# EAGLE schematic Schematic_PM (EAGLE 9.7.0)
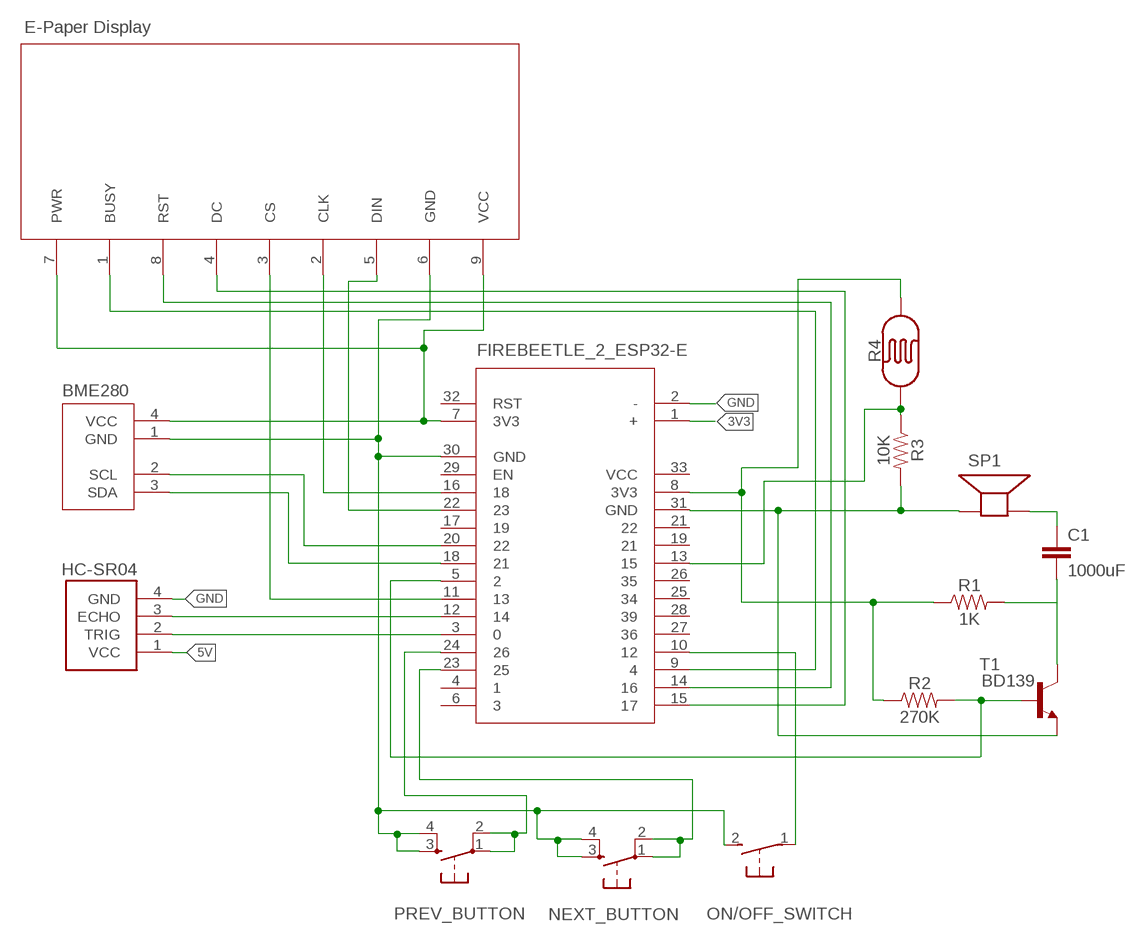
[diagram p0: schematic, sheet 1]

## Parts
BME280  BME280BME280  [WE-LAN_749023010A]
C1  1000uF  DNP-0603_NO_CREAM  [0603_NO_CREAM]
FIREBEETLE_2_ESP32-E  ESP32ESP32  [QFP50P1600X1600X160-100N]
NEXT_BUTTON  SPARKFUN-SWITCHES_MOMENTARY-SWITCH-SPST-2-SMD-4.6X2.8MM  [SPARKFUN-SWITCHES_TACTILE_SWITCH_SMD_4.6X2.8MM]
ON/OFF_SWITCH  31-XXSKINNY  [B3F-31XX-SKINNIER]
PREV_BUTTON  SPARKFUN-SWITCHES_MOMENTARY-SWITCH-SPST-2-SMD-4.6X2.8MM  [SPARKFUN-SWITCHES_TACTILE_SWITCH_SMD_4.6X2.8MM]
R1  1K  1.07KOHM0402-0.1%-1/10W  [0402-TIGHT]
R2  270K  15KOHM-0402-TIGHT-1/16THW-1%  [0402-TIGHT]
R3  10K  10KOHM-0402-1/10W-0.1%  [0402-TIGHT]
R4  PHOTOCELLPTH-KIT  [PHOTOCELL-KIT]
SP1  SPEAKER/PS12  [PS12]
T1  BD139  [TO126]
U1  HC-SR04  [XCVR_HC-SR04]
U$1  EPAPEREPAPER  [LS021C]

## Nets
3V3: FIREBEETLE_2_ESP32-E.1(+)
5V: U1.1(VCC)
GND: FIREBEETLE_2_ESP32-E.2(-) U1.4(GND)
N$1: FIREBEETLE_2_ESP32-E.12 U1.3(ECHO)
N$2: FIREBEETLE_2_ESP32-E.3 U1.2(TRIG)
N$3: BME280.2(SCL) FIREBEETLE_2_ESP32-E.20
N$4: BME280.3(SDA) FIREBEETLE_2_ESP32-E.18
N$5: BME280.1(GND) FIREBEETLE_2_ESP32-E.30(GND) PREV_BUTTON.4 U$1.6(GND)
N$7: PREV_BUTTON.3
N$8: BME280.4(VCC) FIREBEETLE_2_ESP32-E.7(3V3)
N$9: NEXT_BUTTON.3
N$10: FIREBEETLE_2_ESP32-E.24 PREV_BUTTON.2
N$11: PREV_BUTTON.1
N$12: FIREBEETLE_2_ESP32-E.23 NEXT_BUTTON.2
N$13: NEXT_BUTTON.1
N$14: FIREBEETLE_2_ESP32-E.10 ON/OFF_SWITCH.1(P)
N$15: NEXT_BUTTON.4
N$17: U$1.9(VCC)
N$19: U$1.7(PWR)
N$21: FIREBEETLE_2_ESP32-E.9 U$1.1(BUSY)
N$22: FIREBEETLE_2_ESP32-E.14 U$1.8(RST)
N$23: FIREBEETLE_2_ESP32-E.15 U$1.4(DC)
N$24: FIREBEETLE_2_ESP32-E.11 U$1.3(CS)
N$25: FIREBEETLE_2_ESP32-E.16 U$1.2(CLK)
N$26: FIREBEETLE_2_ESP32-E.22 U$1.5(DIN)
N$27: FIREBEETLE_2_ESP32-E.5
N$28: C1.2 T1.2(C)
N$29: R1.2
N$30: T1.3(B)
N$31: T1.1(E)
N$32: R2.2
N$33: FIREBEETLE_2_ESP32-E.8(3V3) R1.1 R2.1 R4.2
N$34: C1.1 SP1.P$2(-)
N$35: FIREBEETLE_2_ESP32-E.31(GND) R3.2 SP1.P$1(+)
N$36: ON/OFF_SWITCH.2(S)
N$38: FIREBEETLE_2_ESP32-E.13 R3.1 R4.1
Unconnected: FIREBEETLE_2_ESP32-E.4 FIREBEETLE_2_ESP32-E.6 FIREBEETLE_2_ESP32-E.17 FIREBEETLE_2_ESP32-E.19 FIREBEETLE_2_ESP32-E.21 FIREBEETLE_2_ESP32-E.25 FIREBEETLE_2_ESP32-E.26 FIREBEETLE_2_ESP32-E.27 FIREBEETLE_2_ESP32-E.28 FIREBEETLE_2_ESP32-E.29(EN) FIREBEETLE_2_ESP32-E.32(RST) FIREBEETLE_2_ESP32-E.33(VCC)

## Notes on the sheet
- E-Paper Display

## Library data of the parts
BME280 = ESP32:BME280
C1 = SparkFun-Capacitors:DNP: Do-Not-Populate capacitor; VALUE: DNP
FIREBEETLE_2_ESP32-E = ESP32:ESP32
NEXT_BUTTON PREV_BUTTON = Library:SPARKFUN-SWITCHES_MOMENTARY-SWITCH-SPST-2: Momentary Switch (Pushbutton) - SPST - Two Circuits Normally-open (NO) SPST momentary switches (buttons, pushbuttons). Schematic symbol includes two switch circuits. Variants SMD-4.6MMX2.8MM - 4.60mm x 2.80mm Tactile Momentary Button Switch - Used on SparkFun SAMD21 Mini Breakout <https://www.sparkfun.com/products/13664> SMD-5.2MM - Mini Pushbutton Switch - SMD <https://www.sparkfun.com/products/8720> - Used on Arduino Pro Mini <https://www.sparkfun.com/products/11114>; PROD_ID: SWCH-14139; SF_SKU: COM-08720
ON/OFF_SWITCH = adafruit:31-XX: OMRON SWITCH Now with beefier pads!
R1 = SparkFun-Resistors:1.07KOHM; PROD_ID: RES-16146; VALUE: 1.07K
R2 = SparkFun-Resistors:15KOHM: 15kΩ resistor A resistor is a passive two-terminal electrical component that implements electrical resistance as a circuit element. Resistors act to reduce current flow, and, at the same time, act to lower voltage levels within circuits. - Wikipedia; PROD_ID: RES-15004; VALUE: 15K
R3 = SparkFun-Resistors:10KOHM: 10kΩ resistor A resistor is a passive two-terminal electrical component that implements electrical resistance as a circuit element. Resistors act to reduce current flow, and, at the same time, act to lower voltage levels within circuits. - Wikipedia; PROD_ID: RES-16147
R4 = SparkFun-Sensors:PHOTOCELL: Photocell (Photodetector, Photo Resistor, CdS) This is a very small light sensor. A photocell changes (also called a photodetector, photo resistor, CdS or photoconductive cell) resistance depending on the amount of light it is exposed to. These little sensors make great ambient light triggers (when light in the room turns on, do something). Datasheet <http://cdn.sparkfun.com/datasheets/Sensors/LightImaging/SEN-09088.pdf> SparkFun Products Mini Photocell <https://www.sparkfun.com/products/9088> (SEN-09088); PROD_ID: COMP-09129; SF_ID: SEN-09088
SP1 = adafruit:SPEAKER: SPEAKER Source: Buerklin Added PS12 (for part # PS1240 piezo) http://www.ladyada.net/library/pcb/eaglelibrary.html
T1 = BD139:BD139: NPN TRANSISTOR Check availability <https://pricing.snapeda.com/parts/BD139/STMicroelectronics/view-part?ref=eda>; AVAILABILITY: In Stock; CHECK_PRICES: https://www.snapeda.com/parts/BD139/STMicroelectronics/view-part/?ref=eda; DESCRIPTION: Bipolar (BJT) Transistor NPN 80 V 1.5 A - 1.25 W Through Hole SOT-32-3; MF: STMicroelectronics; MP: BD139; PACKAGE: TO-126 STMicroelectronics; PRICE: None; PURCHASE-URL: https://www.snapeda.com/api/url_track_click_mouser/?unipart_id=4593470&manufacturer=STMicroelectronics&part_name=BD139&search_term=None; SNAPEDA_LINK: https://www.snapeda.com/parts/BD139/STMicroelectronics/view-part/?ref=snap
U1 = HC-SR04:HC-SR04: Ultrasonic Sensor Module Check availability <https://pricing.snapeda.com/parts/HC-SR04/SparkFun%20Electronics/view-part?ref=eda>; AVAILABILITY: Not in stock; CHECK_PRICES: https://www.snapeda.com/parts/HC-SR04/SparkFun+Electronics/view-part/?ref=eda; DESCRIPTION: HC-SR04 Ultrasonic Sensor Qwiic Platform Evaluation Expansion Board; MF: SparkFun Electronics; MP: HC-SR04; PACKAGE: None; PRICE: None; SNAPEDA_LINK: https://www.snapeda.com/parts/HC-SR04/SparkFun+Electronics/view-part/?ref=snap
U$1 = ESP32:EPAPER